# Altium schematic sheet FTDI_USB_To_UART.SchDoc
size A3; SheetNumber: 6; SheetTotal: 7
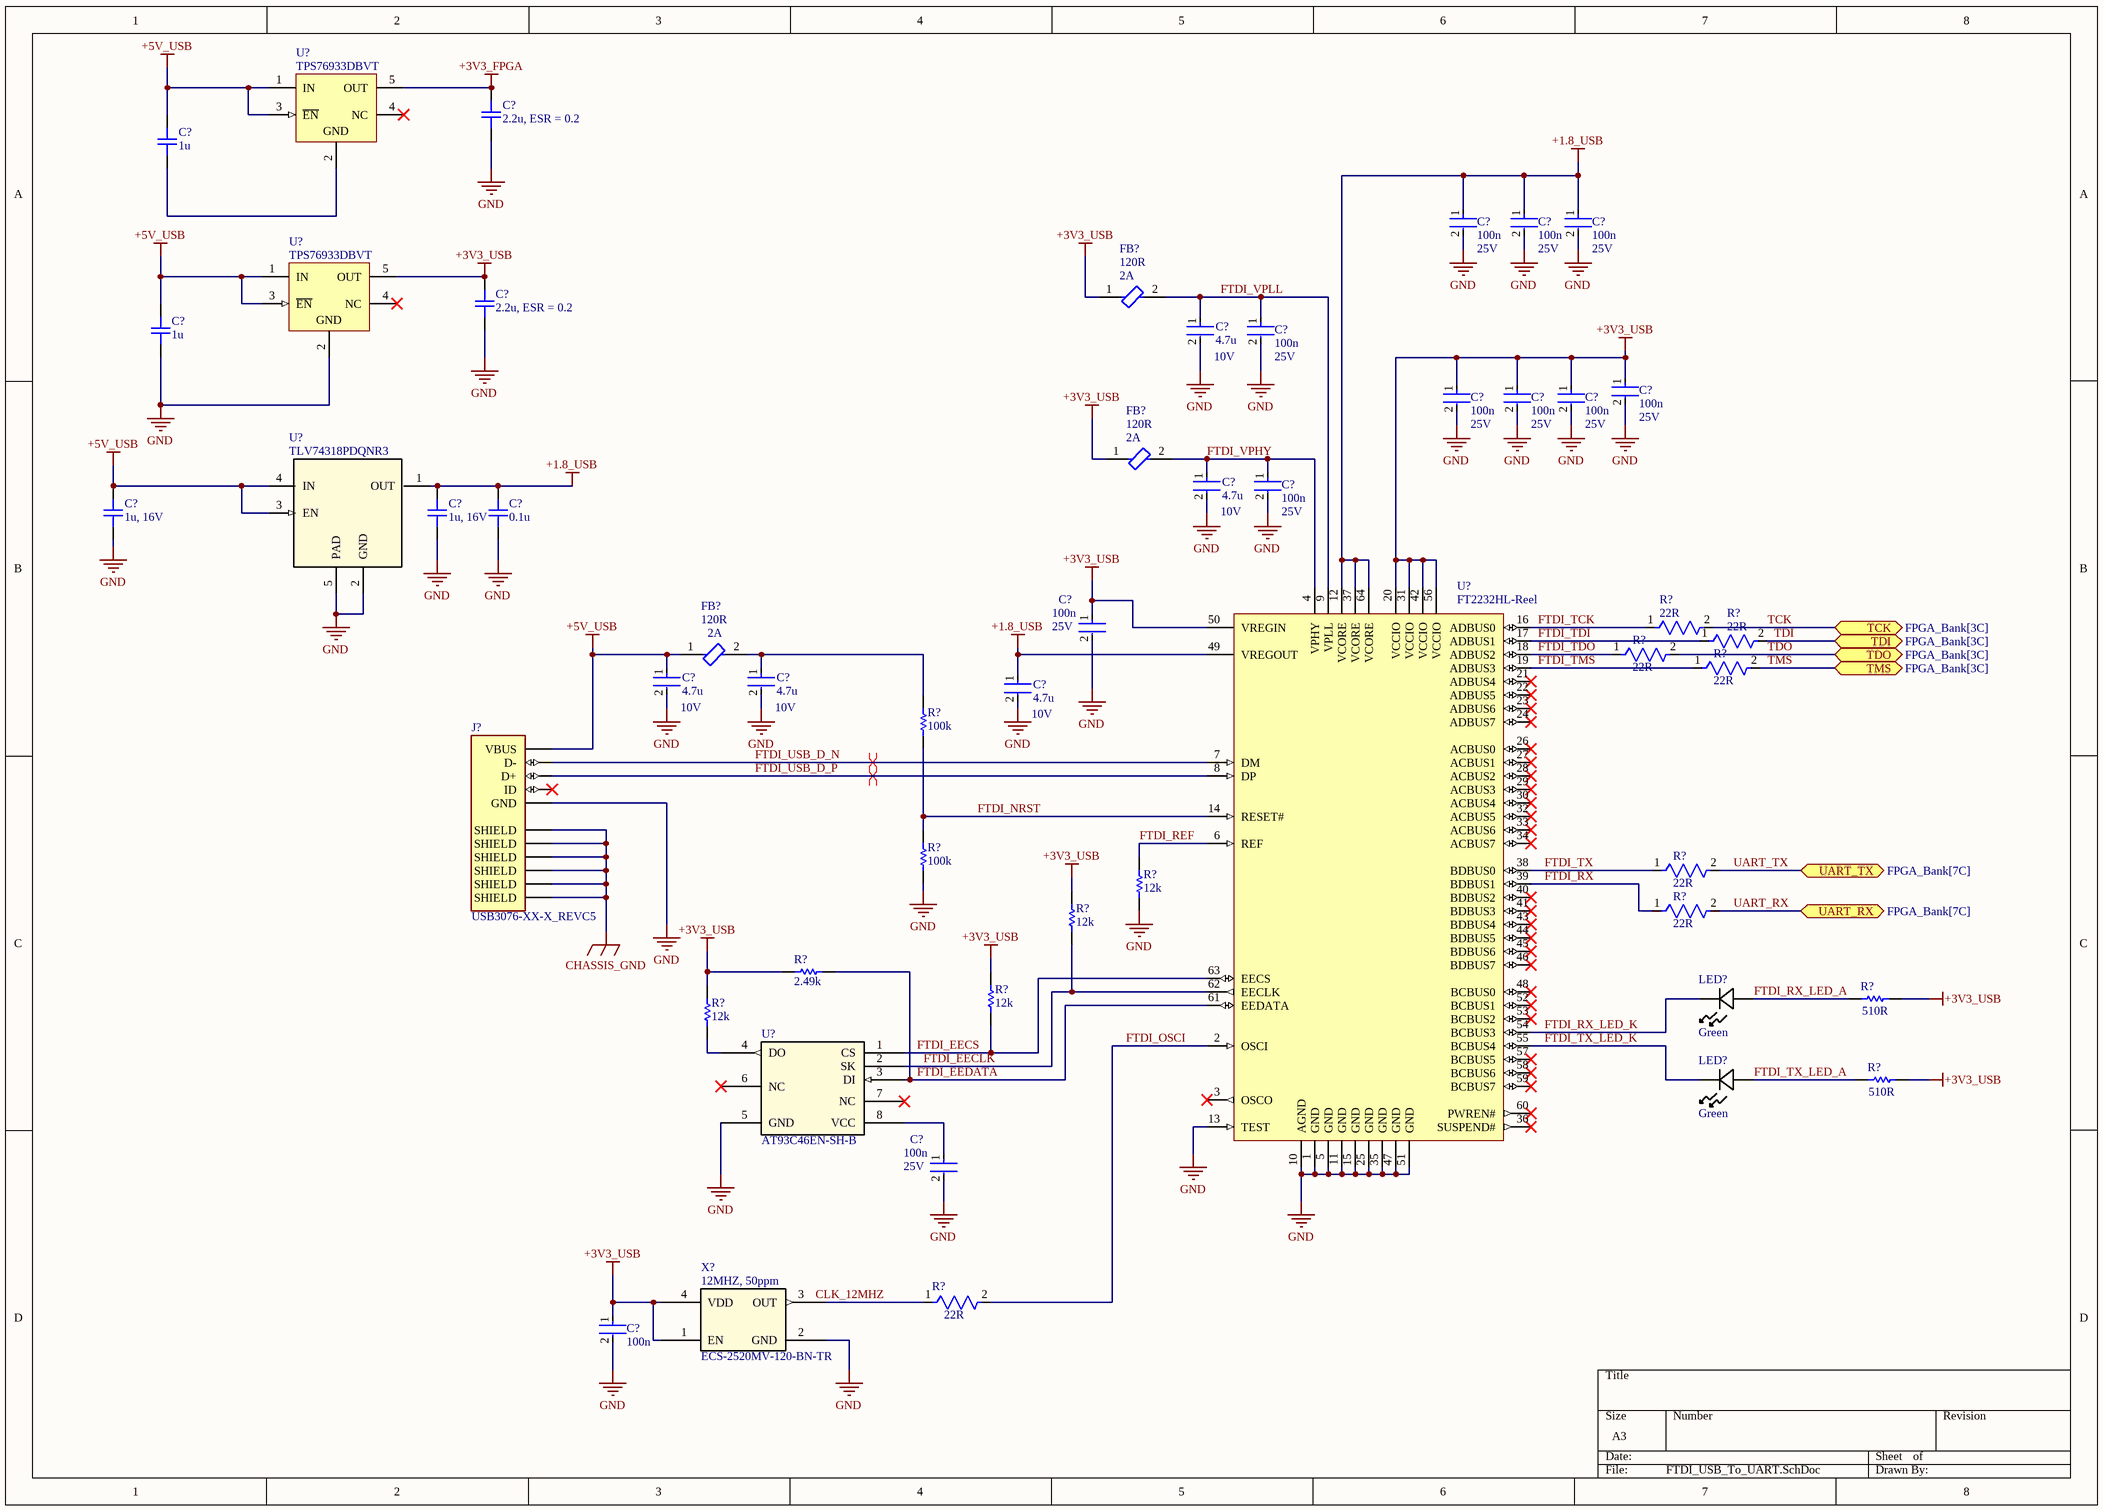
[diagram p0: FTDI_USB_To_UART.SchDoc]

## Parts
(Parts that share a designator on the sheet are numbered #1, #2 ... from top to bottom, then left to right.)
C?#1  2.2u, ESR = 0.2  [CAP_0603]
C?#2  1u  [CAP_0402]
C?#3  100n  [FP-CL278-IPC_C]
C?#4  100n  [FP-CL278-IPC_C]
C?#5  100n  [FP-CL278-IPC_C]
C?#6  2.2u, ESR = 0.2  [CAP_0603]
C?#7  4.7u  [FP-CL282-IPC_C]
C?#8  100n  [FP-CL278-IPC_C]
C?#9  1u  [CAP_0402]
C?#10  100n  [FP-CL278-IPC_C]
C?#11  100n  [FP-CL278-IPC_C]
C?#12  100n  [FP-CL278-IPC_C]
C?#13  100n  [FP-CL278-IPC_C]
C?#14  4.7u  [FP-CL282-IPC_C]
C?#15  100n  [FP-CL278-IPC_C]
C?#16  1u, 16V  [CAP_0402]
C?#17  1u, 16V  [CAP_0402]
C?#18  0.1u  [CAP_0402]
C?#19  100n  [FP-CL278-IPC_C]
C?#20  4.7u  [FP-CL282-IPC_C]
C?#21  4.7u  [FP-CL282-IPC_C]
C?#22  4.7u  [FP-CL282-IPC_C]
C?#23  100n  [FP-CL278-IPC_C]
C?#24  100n  [FP-CL278-IPC_C]
FB?#1  120R  [FP-BLM15-0_05-d0_7-MFG]
FB?#2  120R  [FP-BLM15-0_05-d0_7-MFG]
FB?#3  120R  [FP-BLM15-0_05-d0_7-MFG]
J?  USB3076-XX-X_REVC5  [GCT_USB3076-XX-X_REVC5]
LED?#1  Green  [LED_LTW-C193TS5_LTO]
LED?#2  Green  [LED_LTW-C193TS5_LTO]
R?#1  22R  [FP-RC0402-0_4-MFG]
R?#2  22R  [FP-RC0402-0_4-MFG]
R?#3  22R  [FP-RC0402-0_4-MFG]
R?#4  22R  [FP-RC0402-0_4-MFG]
R?#5  100k  [RESC1005X40X25NL05T10]
R?#6  100k  [RESC1005X40X25NL05T10]
R?#7  22R  [FP-RC0402-0_4-MFG]
R?#8  12k  [RESC1005X40X25NL05T10]
R?#9  22R  [FP-RC0402-0_4-MFG]
R?#10  12k  [RESC1005X40X25NL05T10]
R?#11  2.49k  [RESC1005X40X25NL05T10]
R?#12  510R  [RESC1005X40X25LL05T05]
R?#13  12k  [RESC1005X40X25NL05T10]
R?#14  12k  [RESC1005X40X25NL05T10]
R?#15  510R  [RESC1005X40X25LL05T05]
R?#16  22R  [FP-RC0402-0_4-MFG]
U?#1  TPS76933DBVT  [DBV0005A_N]
U?#2  TPS76933DBVT  [DBV0005A_N]
U?#3  TLV74318PDQNR3  [DQN0004A]
U?#4  FT2232HL-Reel  [LQFP-64_M]
U?#5  AT93C46EN-SH-B  [8S1_ATM]
X?  ECS-2520MV-120-BN-TR  [SMD4_ECS-2520MV_ECS]

## Ports
TCK (bidir, see FPGA_Bank[3C]), TDI (bidir, see FPGA_Bank[3C]), TDO (bidir, see FPGA_Bank[3C]), TMS (bidir, see FPGA_Bank[3C]), UART_RX (bidir, see FPGA_Bank[7C]), UART_TX (bidir, see FPGA_Bank[7C])

## Nets
+1.8_USB: C?#3.1 C?#4.1 C?#5.1 C?#17.2 C?#18.2 C?#22.1 U?#3.1(OUT) U?#4.12(VCORE) U?#4.37(VCORE) U?#4.49(VREGOUT) U?#4.64(VCORE)
+3V3_FPGA: C?#1.2 U?#1.5(OUT)
+3V3_USB: C?#6.2 C?#10.1 C?#11.1 C?#12.1 C?#13.1 C?#19.1 C?#24.1 FB?#1.1 FB?#2.1 R?#10.2 R?#11.1 R?#12.2 R?#13.2 R?#14.2 R?#15.2 U?#2.5(OUT) U?#4.20(VCCIO) U?#4.31(VCCIO) U?#4.42(VCCIO) U?#4.50(VREGIN) U?#4.56(VCCIO) X?.1(EN) X?.4(VDD)
+5V_USB: C?#2.2 C?#9.2 C?#16.2 C?#20.1 FB?#3.1 J?.1(VBUS) U?#1.1(IN) U?#1.3(~{EN}) U?#2.1(IN) U?#2.3(~{EN}) U?#3.3(EN) U?#3.4(IN)
CHASSIS_GND: J?.6(SHIELD) J?.7(SHIELD) J?.8(SHIELD) J?.9(SHIELD) J?.10(SHIELD) J?.11(SHIELD)
GND: C?#1.1 C?#3.2 C?#4.2 C?#5.2 C?#6.1 C?#7.2 C?#8.2 C?#9.1 C?#10.2 C?#11.2 C?#12.2 C?#13.2 C?#14.2 C?#15.2 C?#16.1 C?#17.1 C?#18.1 C?#19.2 C?#20.2 C?#21.2 C?#22.2 C?#23.2 C?#24.2 J?.5(GND) R?#6.1 R?#8.1 U?#2.2(GND) U?#3.2(GND) U?#3.5(PAD) U?#4.1(GND) U?#4.5(GND) U?#4.10(AGND) U?#4.11(GND) U?#4.13(TEST) U?#4.15(GND) U?#4.25(GND) U?#4.35(GND) U?#4.47(GND) U?#4.51(GND) U?#5.5(GND) X?.2(GND)
FTDI_EECLK: R?#10.1 U?#4.62(EECLK) U?#5.2(SK)
FTDI_EECS: R?#13.1 U?#4.63(EECS) U?#5.1(CS)
FTDI_EEDATA: R?#11.2 U?#4.61(EEDATA) U?#5.3(DI)
FTDI_NRST: R?#5.1 R?#6.2 U?#4.14(RESET#)
FTDI_OSCI: R?#16.2 U?#4.2(OSCI)
FTDI_REF: R?#8.2 U?#4.6(REF)
FTDI_RX: R?#9.1 U?#4.39(BDBUS1)
FTDI_RX_LED_A: LED?#1.2 R?#12.1
FTDI_RX_LED_K: LED?#1.1 U?#4.54(BCBUS3)
FTDI_TCK: R?#1.1 U?#4.16(ADBUS0)
FTDI_TDI: R?#2.1 U?#4.17(ADBUS1)
FTDI_TDO: R?#3.1 U?#4.18(ADBUS2)
FTDI_TMS: R?#4.1 U?#4.19(ADBUS3)
FTDI_TX: R?#7.1 U?#4.38(BDBUS0)
FTDI_TX_LED_A: LED?#2.2 R?#15.1
FTDI_TX_LED_K: LED?#2.1 U?#4.55(BCBUS4)
FTDI_USB_D_N: J?.2(D-) U?#4.7(DM)
FTDI_USB_D_P: J?.3(D+) U?#4.8(DP)
FTDI_VPHY: C?#14.1 C?#15.1 FB?#2.2 U?#4.4(VPHY)
FTDI_VPLL: C?#7.1 C?#8.1 FB?#1.2 U?#4.9(VPLL)
TCK: R?#1.2 ; port TCK
TDI: R?#2.2 ; port TDI
TDO: R?#3.2 ; port TDO
TMS: R?#4.2 ; port TMS
UART_RX: R?#9.2 ; port UART_RX
UART_TX: R?#7.2 ; port UART_TX
NetC?#2_1: C?#2.1 U?#1.2(GND)
NetC?#21_1: C?#21.1 FB?#3.2 R?#5.2
NetC?#23_1: C?#23.1 U?#5.8(VCC)
NetR?#14_1: R?#14.1 U?#5.4(DO)
NetR?#16_1: R?#16.1 X?.3(OUT)

Not connected (* = marked no-connect by the designer): J? 4(ID)*; U?#1 4(NC)*; U?#2 4(NC)*; U?#4 3(OSCO)* 21(ADBUS4)* 22(ADBUS5)* 23(ADBUS6)* 24(ADBUS7)* 26(ACBUS0)* 27(ACBUS1)* 28(ACBUS2)* 29(ACBUS3)* 30(ACBUS4)* 32(ACBUS5)* 33(ACBUS6)* 34(ACBUS7)* 36(SUSPEND#)* 40(BDBUS2)* 41(BDBUS3)* 43(BDBUS4)* 44(BDBUS5)* 45(BDBUS6)* 46(BDBUS7)* 48(BCBUS0)* 52(BCBUS1)* 53(BCBUS2)* 57(BCBUS5)* 58(BCBUS6)* 59(BCBUS7)* 60(PWREN#)*; U?#5 6(NC)* 7(NC)*

## Layout directives
differential pair: FTDI_USB_D_N, FTDI_USB_D_P

## Notes on the sheet
- (near FB?#1) 2A
- (near C?#3) 25V
- (near C?#4) 25V
- (near C?#5) 25V
- (near C?#7) 10V
- (near C?#8) 25V
- (near FB?#2) 2A
- (near C?#11) 25V
- (near C?#12) 25V
- (near C?#13) 25V
- (near C?#10) 25V
- (near C?#14) 10V
- (near C?#15) 25V
- (near FB?#3) 2A
- (near C?#19) 25V
- (near C?#20) 10V
- (near C?#21) 10V
- (near C?#22) 10V
- (near C?#23) 25V
- (near X?) 12MHZ, 50ppm
- Labels drawn without touching a wire or pin: CLK_12MHZ

## Library data of the parts
C?#1 C?#6 = CAP_0603: Capacitor SMD 0603; Manufacturer: *; Manufacturer Part Number: *; Distributor Link: *; LCSC: *; Rating: *; Dielectric: *
C?#2 C?#9 C?#16-C?#18 = CAP_0402: Capacitor SMD 0402; Manufacturer: *; Manufacturer Part Number: *; Distributor Link: *; LCSC: *; Rating: *; Dielectric: *
C?#3-C?#5 C?#8 C?#10-C?#13 C?#15 C?#19 C?#23 C?#24 = CMP-13271-000728-1: Cap Ceramic 100nF 25V X5R ±10% SMD 0402 +85°C Paper T/R; Package Quantity: 1; Height: 0.5mm; Case Code (Metric): 1005; Thickness: 0.022inch; Mount: Surface Mount; Lead Free: Lead Free; Case Code (Imperial): 0402; Packaging: Tape and Reel; Depth: 0.5mm; Voltage: 25V; Min Operating Temperature: -55°C; Voltage Rating: 25V; Dielectric: X5R; Case/Package: 0402; Tolerance: 10%; Width: 0.02inch; Max Operating Temperature: 85°C; Capacitance: 100nF; Length: 1mm; Radiation Hardening: No; Voltage Rating (DC): 25V
C?#7 C?#14 C?#20-C?#22 = CMP-13271-000548-1: Cap Ceramic 4.7uF 10V X5R ±20% SMD 0402 +85°C Paper T/R; Capacitance: 4.7uF; Max Operating Temperature: 85°C; Lead Free: Lead Free; Tolerance: 20%; Voltage Rating: 10V; Dielectric: X5R; Width: 0.02inch; Length: 0.039inch; Case/Package: 0402; Min Operating Temperature: -55°C; Packaging: Tape and Reel; Thickness: 0.022inch; Case Code (Imperial): 0402; Package Quantity: 10000; Case Code (Metric): 1005; Mount: Surface Mount
FB?#1-FB?#3 = CMP-0686-00133-3: Chip Ferrite Bead, 0402, 120Ω @ 100MHz, 0.055Ω, 25%, 2A; DC Resistance (DCR): 55mR; Number of Circuits: 1; Material: Steel; Lead Free: Lead Free; Package Quantity: 10000; Impedance: 120R; Width: 0.5mm; Case Code (Metric): 1005; Test Frequency: 100MHz; Weight: 2.3E-05oz; Max DC Current: 2A; Current Rating: 2A; REACH SVHC: No SVHC; Case Code (Imperial): 0402; Min Operating Temperature: -55°C; Max Operating Temperature: 125°C; Max Current Rating: 2A; Series: EMIFIL®, BLM15P; Tolerance: 25%; Termination: SMD/SMT; Number of Lines: 1; Case/Package: 0402; RoHS Compliant: Yes; Number of Pins: 2; Length: 1mm; Height: 0.5mm; Packaging: Tape and Reel
J? = USB3076-XX-X_REVC5: USB - micro B USB 2.0 Receptacle Connector 5 Position Surface Mount, Right Angle; Through Hole, 2.35mm profile, 5 Pins, Horizontal, Bottom mount; MP: USB3076-30-A; MF: Global Connector Technology; SnapEDA_Link: https://www.snapeda.com/parts/USB3076-30-A/Global+Connector+Technology/view-part/?ref=snap; Package: None; Check_prices: https://www.snapeda.com/parts/USB3076-30-A/Global+Connector+Technology/view-part/?ref=eda; Purchase-URL: https://pricing.snapeda.com/search/part/USB3076-30-A/?ref=eda; Price: None; Value: *; Availability: In Stock
LED?#1 LED?#2 = LTST-C191TGKT: No Description Available; Manufacturer_Name: LITE-ON; Copyright: Copyright (C) 2025 Ultra Librarian. All rights reserved.; Manufacturer_Part_Number: LTST-C191TGKT
R?#1-R?#4 R?#7 R?#9 R?#16 = CMP-2002-07520-2: Tolerance: 1%; Power Rating: 63mW; Voltage Rating: 50V; Temperature Coefficient: 100ppm/°C; Resistance: 22Ω; Termination: SMD/SMT; Depth: 500µm; Packaging: Tape & Reel; Height: 400µm; Width: 500µm; Case Code (Imperial): 0402; Length: 1mm; Schedule B: 8533210045, 8533210045; Case/Package: 0402; Max Operating Temperature: 155°C; Min Operating Temperature: -55°C; REACH SVHC: Unknown; RoHS: Compliant; Military Standard: Not; Voltage Rating (DC): 50V; Lead Free: Lead Free; Voltage Rating (AC): 50V; Number of Pins: 2; Composition: Thick Film
R?#5 R?#6 R?#8 R?#10 R?#13 R?#14 = CMP-2002-07343-1: Part Number: RC0402FR-07100KL; Manufacturer: Yageo / Phycomp
R?#11 = CMP-2002-07571-1: Part Number: RC0402FR-072K49L; Manufacturer: Yageo
R?#12 R?#15 = CMP-2002-00074-1: Part Number: CRCW0402510RFKED; Manufacturer: Vishay Dale
U?#1 U?#2 = CMP-0394-00641-2: Single Output LDO, 100 mA, Fixed 3.3 V Output, 2.7 to 10 V Input, with Low IQ, 5-pin SOT-23 (DBV), -40 to 125 degC, Green (RoHS & no Sb/Br); Manufacturer: Texas Instruments; Rating: Catalog; Accuracy(%): 3; Iout(Max)(A): 0.1; SubFamily: Single Channel LDO; Vout Adj(Min)(V): 3.3; Iq(Typ)(mA): 0.02; Vdo(Typ)(mV): 98; Vin(Max)(V): 10; Vin(Min)(V): 2.7; ComponentLink4Description: URL Link1; PackageReference: DBV0005A; ComponentLink2URL: http://www.ti.com/general/docs/lit/getliterature.tsp?genericPartNumber=TPS76933&fileType=pdf; PartNumber: TPS76933DBVT; ComponentLink4URL: Samples URL:http://www.ti.com/product/tps76933#samples; ComponentLink2Description: Datasheet; ComponentLink3Description: Package Specification; Fixed Output Options(V): 3.3; PackageDescription: 5-Pin Plastic Small Outline, Body 1.60 Ãƒâ€” 2.90 mm, Pitch 0.95 mm; Vout Adj(Max)(V): 3.3; ComponentLink1Description: Manufacturer URL; Code_JEDEC: MO-178; DatasheetVersion: SLVS203E; PackageVersion: 4073253-4/K; ComponentLink1URL: http://www.ti.com/; ComponentLink3URL: http://www.ti.com/litv/pdf/mpds018i; Eco-Plan: Green (RoHS & no Sb/Br); Mounting Technology: Surface Mount
U?#3 = TLV74318PDQNR3: 300mA low-Iq low-dropout (LDO) voltage regulator with enable 4-X2SON -40 to 125; Manufacturer_Name: Texas Instruments; TYPE: TYPE; RefDes: RefDes; Copyright: Copyright (C) 2025 Ultra Librarian. All rights reserved.; Manufacturer_Part_Number: TLV74318PDQNR3; Datasheet: https://www.ti.com/lit/gpn/tlv743p
U?#4 = CMP-0078-00023-3: Dual High Speed USB To Multipurpose UART/FIFO IC, 64-pin LQFP, Tape and Reel; Manufacturer: FTDI; DatasheetVersion: ver 2.21, Jun-2012; ComponentLink1URL: http://www.ftdichip.com/; PartNumber: FT2232HL-Reel; ComponentLink2Description: Datasheet; RevisionNote: DatasheetVersion updated to 2.21 Jun-2012; PackageVersion: Jun-12; ComponentLink1Description: Manufacturer URL; ComponentLink2URL: http://www.ftdichip.com/Support/Documents/DataSheets/ICs/DS_FT2232H.pdf; PackageReference: LQFP-64; PackageDescription: 64-Pin Thin Quad Flat Pack, 10 x 10 x 1.4 mm Body, 0.5 mm Pitch
U?#5 = AT93C46EN-SH-B: No Description Available; Manufacturer_Name: Microchip; Copyright: Copyright (C) 2025 Ultra Librarian. All rights reserved.; Manufacturer_Part_Number: AT93C46EN-SH-B; RefDes: RefDes; Type: Type
X? = ECS-2520MV-120-BN-TR: Description; Manufacturer_Name: ECS International; Copyright: Copyright (C) 2025 Ultra Librarian. All rights reserved.; Manufacturer_Part_Number: ECS-2520MV-120-BN-TR; RefDes: RefDes; Type: Type